# Altium schematic sheet High Voltage H-Bridge.SchDoc: High Voltage H-Bridge
size Letter; Date: 2017-01-26; DocumentNumber: 7; Revision: A; SheetNumber: 7; SheetTotal: 16; DesignedBy: Mike MacKay
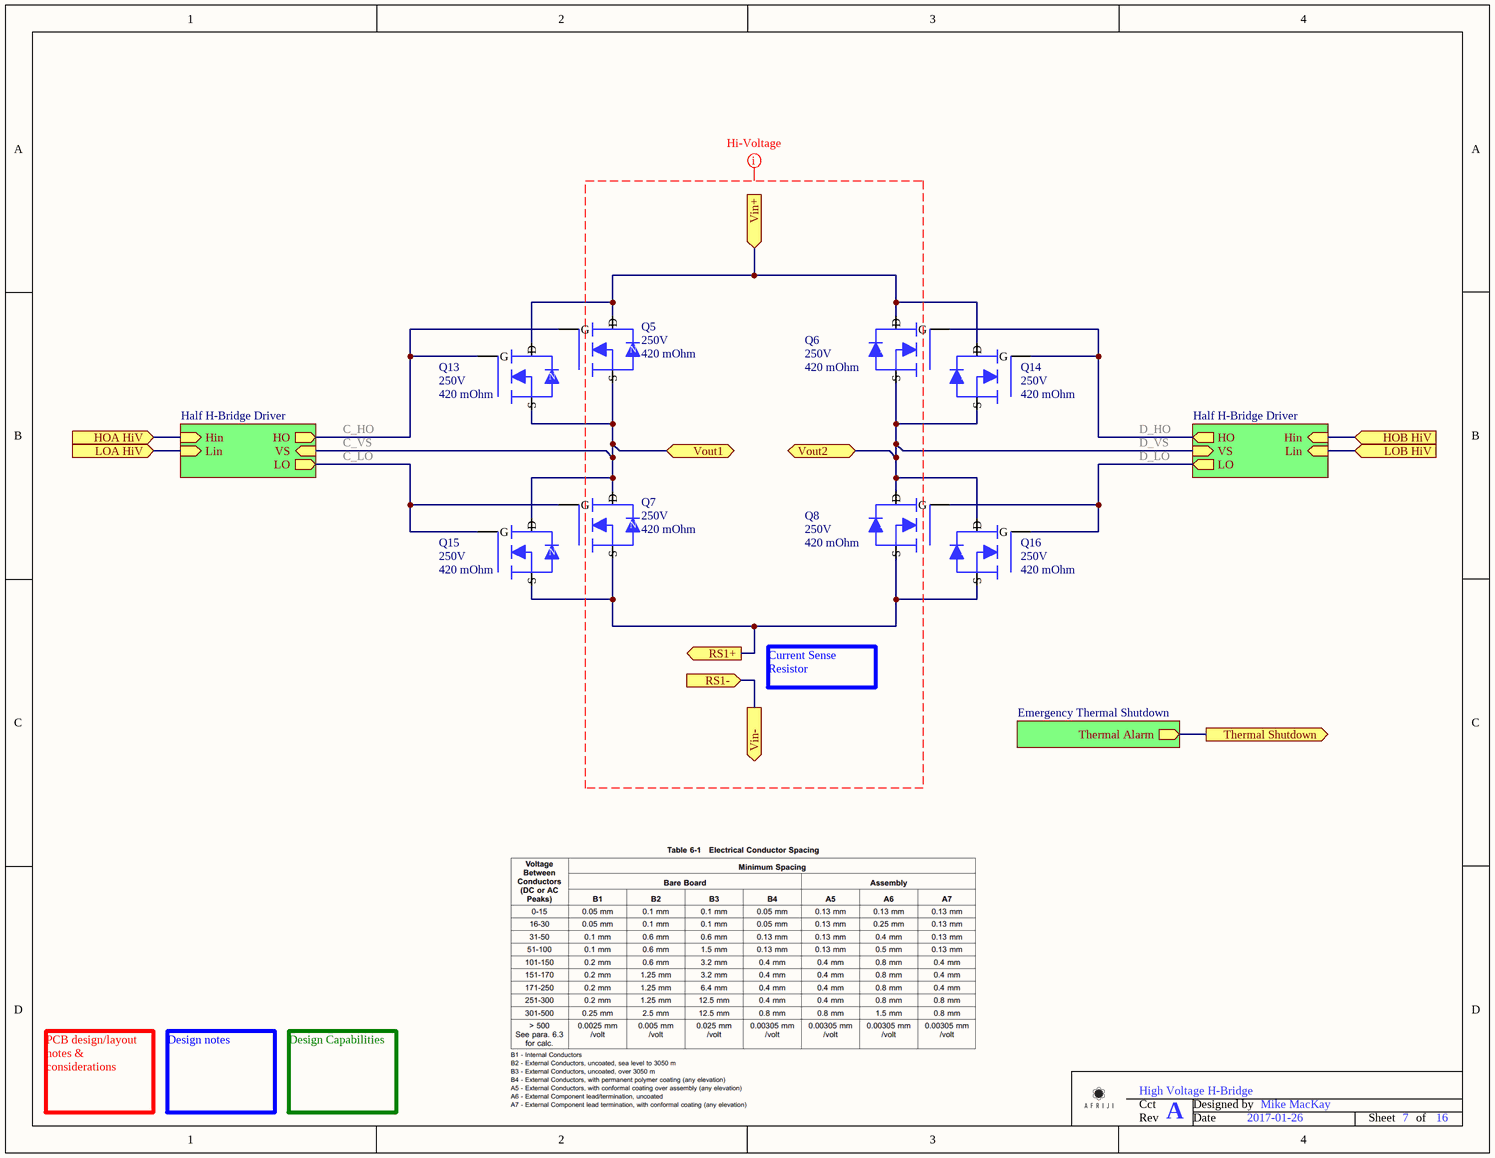
[diagram p0: High Voltage H-Bridge.SchDoc]

## Parts
Q5  Drain to Source Voltage (Vdss): 250V  Rds On (Max) @ Id, Vgs: 420 mOhm  [DPAK]  (hidden comment: N-MOSFET 420mR 250V)
Q6  Drain to Source Voltage (Vdss): 250V  Rds On (Max) @ Id, Vgs: 420 mOhm  [DPAK]  (hidden comment: N-MOSFET 420mR 250V)
Q7  Drain to Source Voltage (Vdss): 250V  Rds On (Max) @ Id, Vgs: 420 mOhm  [DPAK]  (hidden comment: N-MOSFET 420mR 250V)
Q8  Drain to Source Voltage (Vdss): 250V  Rds On (Max) @ Id, Vgs: 420 mOhm  [DPAK]  (hidden comment: N-MOSFET 420mR 250V)
Q13  Drain to Source Voltage (Vdss): 250V  Rds On (Max) @ Id, Vgs: 420 mOhm  [DPAK]  (hidden comment: N-MOSFET 420mR 250V)
Q14  Drain to Source Voltage (Vdss): 250V  Rds On (Max) @ Id, Vgs: 420 mOhm  [DPAK]  (hidden comment: N-MOSFET 420mR 250V)
Q15  Drain to Source Voltage (Vdss): 250V  Rds On (Max) @ Id, Vgs: 420 mOhm  [DPAK]  (hidden comment: N-MOSFET 420mR 250V)
Q16  Drain to Source Voltage (Vdss): 250V  Rds On (Max) @ Id, Vgs: 420 mOhm  [DPAK]  (hidden comment: N-MOSFET 420mR 250V)

## Sub-sheets
Emergency Thermal Shutdown = Emergency Thermal Shutdown.SchDoc: Thermal Alarm (out)
Half H-Bridge Driver = Half H-Bridge Driver.SchDoc: HO (out), VS (in), LO (out), Hin (in), Lin (in)
Half H-Bridge Driver = Half H-Bridge Driver.SchDoc: HO (out), VS (in), LO (out), Hin (in), Lin (in)

## Ports
HOA HiV (in), HOB HiV (in), LOA HiV (in), LOB HiV (in), RS1+ (out), RS1- (in), Thermal Shutdown (out), Vin+ (in), Vin- (out), Vout1 (bidir), Vout2 (bidir)

## Nets
C_HO: Q5.1(G) Q13.1(G) ; sheet Half H-Bridge Driver/HO
C_LO: Q7.1(G) Q15.1(G) ; sheet Half H-Bridge Driver/LO
C_VS: Q5.3(S) Q7.2(D) Q13.3(S) Q15.2(D) ; port Vout1, sheet Half H-Bridge Driver/VS
D_HO: Q6.1(G) Q14.1(G) ; sheet Half H-Bridge Driver/HO
D_LO: Q8.1(G) Q16.1(G) ; sheet Half H-Bridge Driver/LO
D_VS: Q6.3(S) Q8.2(D) Q14.3(S) Q16.2(D) ; port Vout2, sheet Half H-Bridge Driver/VS
HOA HiV: port HOA HiV, sheet Half H-Bridge Driver/Hin
HOB HiV: port HOB HiV, sheet Half H-Bridge Driver/Hin
LOA HiV: port LOA HiV, sheet Half H-Bridge Driver/Lin
LOB HiV: port LOB HiV, sheet Half H-Bridge Driver/Lin
RS1+: Q7.3(S) Q8.3(S) Q15.3(S) Q16.3(S) ; port RS1+
RS1-: port Vin-, port RS1-
Thermal Shutdown: port Thermal Shutdown, sheet Emergency Thermal Shutdown/Thermal Alarm
Vin+: Q5.2(D) Q6.2(D) Q13.2(D) Q14.2(D) ; port Vin+

## Layout directives
net class 171-250V: (no net found under the mark)

## Notes on the sheet
- Current Sense Resistor
- PCB design/layout notes & considerations
- Design notes
- Design Capabilities
- Cct
- Designed by
- Rev
- Date
- Sheet
- of
- (in symbol N-MOSFET 420mR 250V) N

## Library data of the parts
Q5-Q8 Q13-Q16 = N-MOSFET 420mR 250V: Manufacturer: Fairchild/ON Semiconductor; Manufacturer Part Number: FQD9N25TM; FET Type: N-Channel; Current - Continuous Drain (Id) @ 25°C: 7.4A (Tc); Drive Voltage (Max Rds On,  Min Rds On): 10V; Vgs(th) (Max) @ Id: 5V @ 250µA; Gate Charge (Qg) (Max) @ Vgs: 20nC @ 10V; Input Capacitance (Ciss) (Max) @ Vds: 700pF @ 25V; Vgs (Max): ±30V; Power Dissipation (Max): 2.5W (Ta), 55W (Tc); Supplier 1: Digi-Key; Supplier Part Number 1: FQD9N25TMCT-ND; RoHS: RoHS Compliant; Category: Discrete Semiconductor Products; Stock 1: 4941; Pricing 1: 1=0.86, 10=0.766, 100=0.597, 500=0.49316, 1000=0.38934 (USD); Packaging: Cut Tape (CT); Part Status: Active; Technology: MOSFET (Metal Oxide); FET Feature: -; Operating Temperature: -55°C ~ 150°C (TJ); Mounting Type: Surface Mount; Supplier Device Package: D-Pak; Package / Case: TO-252-3, DPak (2 Leads + Tab), SC-63; ComponentLink1URL: https://www.fairchildsemi.com/datasheets/FQ/FQD9N25.pdf; ComponentLink1Description: Spec Sheet